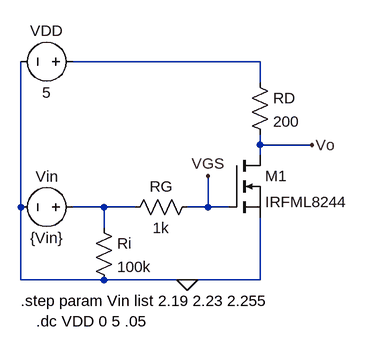
[diagram p0: schematic 3_2_g.asc]
3_2_g.asc, the LTspice schematic file:
Version 4
SHEET 1 880 680
WIRE 384 -64 96 -64
WIRE 384 -32 384 -64
WIRE 384 64 384 48
WIRE 464 64 384 64
WIRE 384 80 384 64
WIRE 16 160 16 -64
WIRE 144 160 96 160
WIRE 192 160 144 160
WIRE 304 160 304 112
WIRE 304 160 272 160
WIRE 336 160 304 160
WIRE 144 192 144 160
WIRE 16 272 16 160
WIRE 144 272 16 272
WIRE 272 272 144 272
WIRE 384 272 384 176
WIRE 384 272 272 272
FLAG 272 272 0
FLAG 464 64 Vo
FLAG 304 112 VGS
SYMBOL voltage 112 160 R90
WINDOW 0 -32 56 VBottom 2
WINDOW 3 32 56 VTop 2
SYMATTR InstName Vin
SYMATTR Value {Vin}
SYMBOL res 128 176 R0
SYMATTR InstName Ri
SYMATTR Value 100k
SYMBOL res 288 144 R90
WINDOW 0 0 56 VBottom 2
WINDOW 3 32 56 VTop 2
SYMATTR InstName RG
SYMATTR Value 1k
SYMBOL res 368 -48 R0
SYMATTR InstName RD
SYMATTR Value 200
SYMBOL voltage 112 -64 R90
WINDOW 0 -32 56 VBottom 2
WINDOW 3 32 56 VTop 2
SYMATTR InstName VDD
SYMATTR Value 5
SYMBOL nmos 336 80 R0
SYMATTR InstName M1
SYMATTR Value IRFML8244
TEXT 16 304 Left 2 !.step param Vin list 2.19 2.23 2.255
TEXT 40 336 Left 2 !.dc VDD 0 5 .05

The netlist it stands for:
* 3_2_g.asc
Vin N002 0 {Vin}
Ri N002 0 100k
RG VGS N002 1k
RD N001 Vo 200
VDD N001 0 5
M1 Vo VGS 0 0 IRFML8244
.model NMOS NMOS
.model PMOS PMOS
.lib standard.mos
.step param Vin list 2.19 2.23 2.255
.dc VDD 0 5 .05
.backanno
.end